# Altium project DetectorOptode.PrjPcb
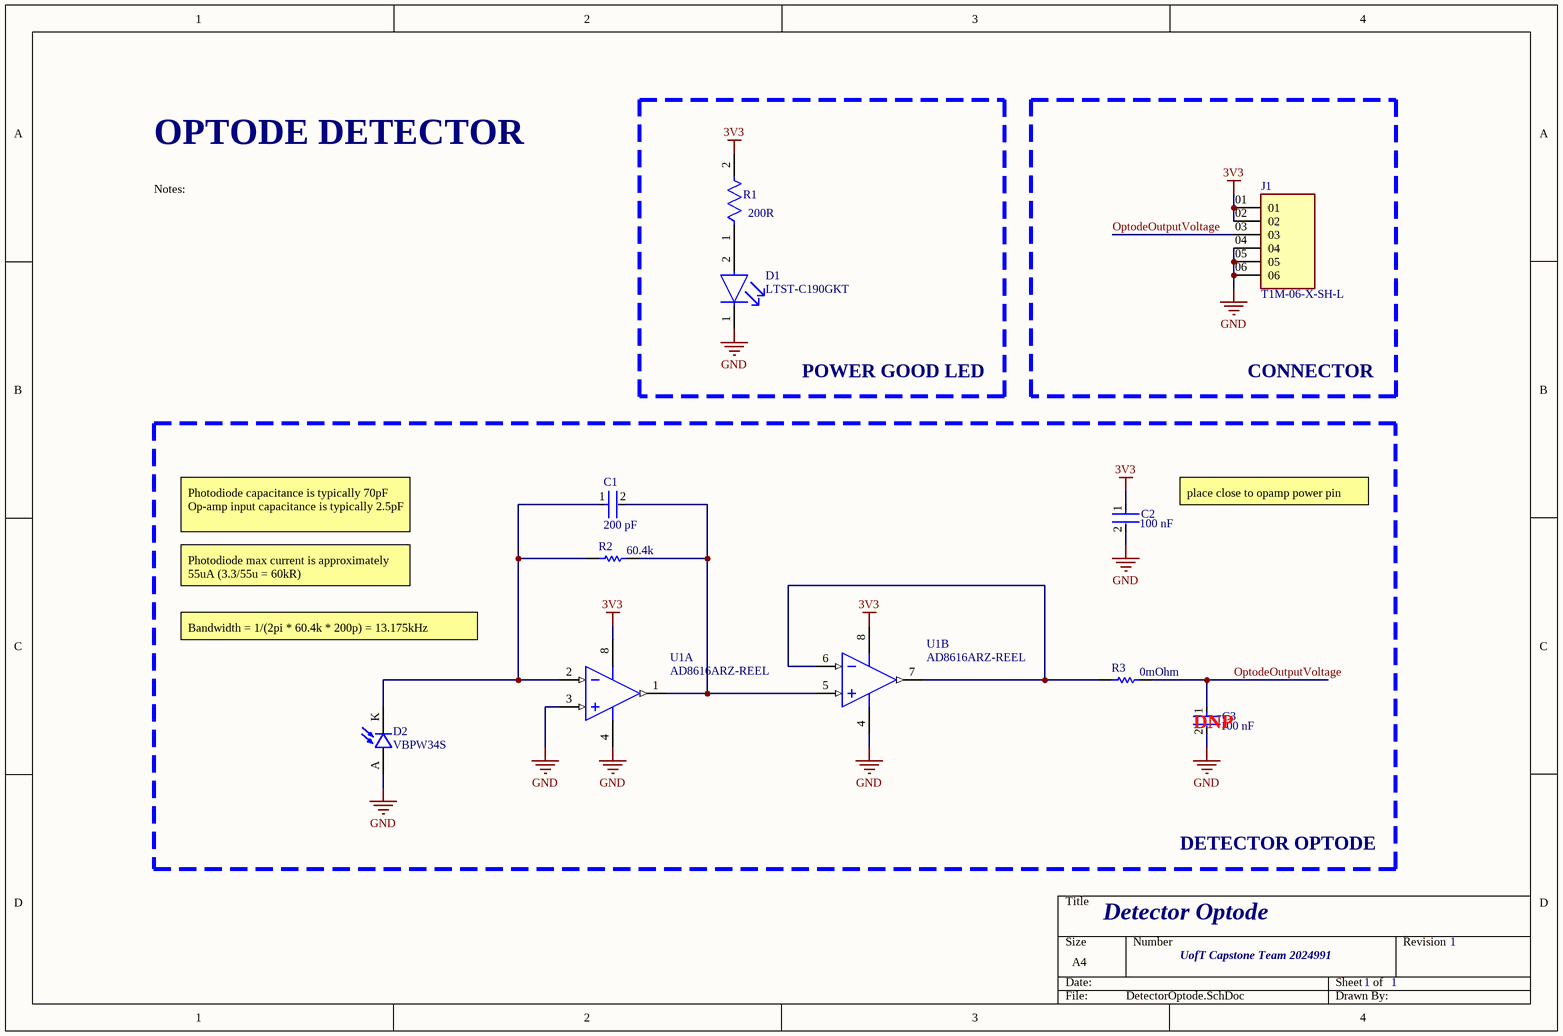
[diagram p0: DetectorOptode.SchDoc]
1 sheet, 10 parts. Net scope: global (net labels, ports and power ports of the same name join across sheets).
Board file: DetectorOptode.PcbDoc

## Sheet DetectorOptode.SchDoc: Detector Optode
size A4; CompanyName: UofT Capstone Team 2024991; Revision: 1; SheetNumber: 1; SheetTotal: 1

### Parts
C1  Capacitance: 200 pF  [FP-C0603C-CF-MFG]  (hidden comment: C0603C201J5GACTU)
C2  Capacitance: 100 nF  [FP-CC0603-DA-MFG]  (hidden comment: CC0603KRX7R7BB104)
C3  Capacitance: 100 nF  [FP-CC0603-DA-MFG]  (hidden comment: CC0603KRX7R7BB104)
D1  LTST-C190GKT  [FP-LTST-C190GKT-MFG]
D2  VBPW34S  [XDCR_VBPW34S]
J1  T1M-06-X-SH-L  [SAMTEC_T1M-06-X-SH-L]
R1  Resistance: 200R  [FP-CRCW0603-e3-MFG]  (hidden comment: CRCW0603200RFKEA)
R2  Resistance: 60.4k  [RESC1608X55X25ML10T15]  (hidden comment: RC0603FR-0760K4L)
R3  Resistance: 0mOhm  [RESC1608X55X25ML10T15]  (hidden comment: RC0603JR-070RL)
U1  AD8616ARZ-REEL  [ADI-R-8_N]  (parts A,B of 2)

### Blocks framed on the sheet
POWER GOOD LED: D1 R1
CONNECTOR: J1

### Nets
3V3: C2.1 J1.01 J1.02 R1.2 U1.8(+V)
GND: C2.2 C3.2 D1.1(C) D2.A J1.04 J1.05 J1.06 U1.3(+IN_A) U1.4(-V)
OptodeOutputVoltage: C3.1 J1.03 R3.2
NetC1_1: C1.1 D2.K(C) R2.1 U1.2(-IN_A)
NetC1_2: C1.2 R2.2 U1.1(OUT_A) U1.5(+IN_B)
NetD1_2: D1.2(A) R1.1
NetR3_1: R3.1 U1.6(-IN_B) U1.7(OUT_B)

### Notes on the sheet
- OPTODE DETECTOR
- Notes:
- place close to opamp power pin
- Photodiode capacitance is typically 70pF
  Op-amp input capacitance is typically 2.5pF
- Photodiode max current is approximately 55uA (3.3/55u = 60kR)
- Bandwidth = 1/(2pi * 60.4k * 200p) = 13.175kHz
- (near C3) DNP
- DETECTOR OPTODE

### Library data of the parts
C1 = CMP-1035-01444-3: CAP CER 200PF 50V 5% NP0 0603; Manufacturer: KEMET; Automotive Grade: Grade 1; Temperature Characteristic: C0G; Temperature Coefficient: 30ppm/°C; Tolerance: 0.05; Material: Ceramic; Temperature Range High: +125°C; Digikey Description: CAP CER 200PF 50V 5% NP0 0603; ComponentLink2Description: Datasheet; Package: C0603C-CF; Value: 200 pF; Mouser Description: Multilayer Ceramic Capacitors MLCC - SMD/SMT 50volts 200pF C0G 5%; Voltage Rating: 50 V; Temperature Range Low: -55°C; Device Class L2: Capacitors; Temperature: -55°C to +125°C; Device Class L1: Passive Components; Device Class L3: Ceramic Capacitors; ComponentLink2URL: https://api.kemet.com/component-edge/download/datasheet/C0603C100J5GACAUTO.pdf; Height: 0.87mm; Automotive: Yes; Octopart: https://octopart.com/c0603c201j5gactu-kemet-9143917; Category: Cap; Manufacturer Part Number: C0603C201J5GACTU; Lead Free: Yes; RoHS: TRUE
C2 C3 = CMP-2000-05002-2: CAP CER 0.1UF 16V X7R 0603; Manufacturer: YAGEO; Tolerance: 0.1; Value: 100 nF; Temperature Coefficient: 15%; Material: Ceramic; Voltage Rating: 16 V; Package: CC0603-DA; ComponentLink2Description: Datasheet; Octopart: https://octopart.com/cc0603krx7r7bb104-yageo-192941; Temperature Range High: +125°C; Digikey Description: CAP CER 0.1UF 16V X7R 0603; Voltage: 16 V; Device Class L2: Capacitors; Height: 0.9mm; Temperature: -55°C to +125°C; Manufacturer Part Number: CC0603KRX7R7BB104; Device Class L1: Passive Components; Device Class L3: Ceramic Capacitors; ComponentLink2URL: http://www.yageo.com/documents/recent/UPY-GPHC_X7R_6.3V-to-50V_18.pdf; Footprint Url: http://www.yageo.com/exep/pages/download/literatures/UPY-C_GEN_24.pdf; RoHS: TRUE; Temperature Range Low: -55°C; Temperature Characteristic: X7R; Lead Free: Yes; Category: Cap; Mouser Description: Multilayer Ceramic Capacitor, CC Series, 0.1 - F, - 10%, X7R, 16 V, 0603 [1608 Metric]; Automotive: No
D1 = CMP-22017-000005-2: LED GREEN CLEAR CHIP SMD; Dominant Wavelength: 569nm; Reverse Voltage: 5V; Lens Color: Colorless; Viewing Angle: 130°; Voltage: 2V; Forward Current: 30mA; Power Dissipation: 100mW; Luminous Intensity: 6mcd; Number of LEDs: 1; Forward Voltage: 2.1V; Wavelength: 565nm; Test Current: 10mA; Min Operating Temperature: -55°C; Lens Style: Clear; Mount: Surface Mount; Width: 0.8mm; Packaging: Tape and Reel; Lens Transparency: Clear; Case Code (Metric): 1608; Depth: 0.8mm; Case Code (Imperial): 0603; Case/Package: 0603; Number of Pins: 2; Max Operating Temperature: 85°C; Lead Free: Lead Free; Number of Elements: 1; Length: 1.6mm; Height: 0.8mm; Package Quantity: 1; Power Rating: 100mW; Radiation Hardening: No; Illumination Color: Green; Color: Green
D2 = VBPW34S: Photodiode 940nm 100ns 130Â° 2-SMD, Gull Wing; MF: Vishay; Price: None; MP: VBPW34S; Value: *; Package: SMD-2 Vishay; SnapEDA_Link: https://www.snapeda.com/parts/VBPW34S/Vishay%20Semiconductor%20Opto%20Division/view-part/139260/?ref=snap; Availability: Unavailable
J1 = T1M-06-X-SH-L: Connector Header Surface Mount, Right Angle 6 position 0.039" (1.00mm); MF: Samtec; Availability: Unavailable; Value: *; Price: None; MP: T1M-06-X-SH-L; Package: None
R1 = CMP-2000-03062-2: RES Thick Film, 200Ω, 1%, 0.1W, 100ppm/°C, 0603; Power Rating: 100mW; Voltage Rating (DC): 75V; Military Standard: Not; Tolerance: 1%; Lead Free: Lead Free; Case Code (Imperial): 0603; Depth: 0.85mm; Max Operating Temperature: 155°C; Contact Plating: Tin; Length: 1.55mm; Weight: 7.1E-05oz; Voltage Rating: 75V; Height: 0.45mm; Min Operating Temperature: -55°C; Case/Package: 0603; Number of Pins: 2; Composition: Thick Film; Termination: SMD/SMT; Case Code (Metric): 1608; Width: 0.85mm; Package Quantity: 5000; Temperature Coefficient: 100ppm/°C; Packaging: Tape and Reel
R2 = CMP-2000-04099-1: Manufacturer: Yageo; Part Number: RC0603FR-0760K4L
R3 = CMP-2100-03667-1: Chip Resistor, 0 Ohm, +/- 5%, 0.1 W, -55 to 155 degC, 0603 (1608 Metric), RoHS, Tape and Reel; Manufacturer: Yageo; Temperature Coefficient: 200ppm/degreesC; Voltage Rating: 50V; Power Rating: 100mW; Width: 0.8mm; Max Operating Temperature: 155degC; Tolerance: 5%; Package Reference: 0603; Height: 0.45mm; Depth: 0.8mm; Package Description: 2-Pin Surface Mount Device, Body 1.6 x 0.8 mm; Termination: SMD/SMT; Package Quantity: 5000; Case/Package: 0603; Case Code (Imperial): 0603; Radiation Hardening: No; Number of Pins: 2; Length: 1.6mm; Lead Free: LeadFree; Voltage Rating (DC): 50V; Military Standard: Not; Datasheet URL: http://www.yageo.com/NewPortal/yageodocoutput?fileName=/pdf/R-Chip/PYu-RC_Group_51_RoHS_L_5.pdf; Manufacturer URL: http://www.yageo.com/; Packaging: TapeandReel; Case Code (Metric): 1608; Min Operating Temperature: -55degC; Composition: ThickFilm; RoHSCompliant: true; Contact Plating: Tin; Datasheet Version: Rev. 5, 10/2016; REACH SVHC: NoSVHC
U1 = CMP-0384-00619-1: Double Channel Wide Bandwidth Operational Amplifier, 24 MHz BW, 12 V/us SR, Industrial, 8-pin SOIC (R-8), Reel; Manufacturer: Analog Devices; Generic Part Number: AD8616; Input Bias Current: 200fA; V Span Max: 6V; Small Signal Bandwidth: 24MHz; Amplifiers Per Package: 2; Slew Rate: 12V/us; V Span Min: 2.7V; Iq/Amp: 2mA; Input Offset Voltage: 23uV; PackageReference: R-8; PartNumber: AD8616ARZ-REEL; DatasheetVersion: Rev. E; ComponentLink2URL: http://www.analog.com/static/imported-files/data_sheets/AD8615_8616_8618.pdf; Code_JEDEC: MS-012-AA; Mounting Technology: Surface Mount; PackageVersion: 060506-A; ComponentLink3Description: Package Specification; ComponentLink3URL: http://www.analog.com/static/imported-files/packages/PKG_PDF/SOIC_Narrow%20(R)/R_8.pdf; ComponentLink1Description: Manufacturer URL; ComponentLink2Description: Datasheet; PackageDescription: 8-Pin Standard Small Outline Package, Body 3.9 x 4.9 mm, Pitch 1.27 mm; ComponentLink1URL: http://www.analog.com/en/index.html